# EAGLE design PiezoPreamp_V3 (EAGLE 7.5.0)
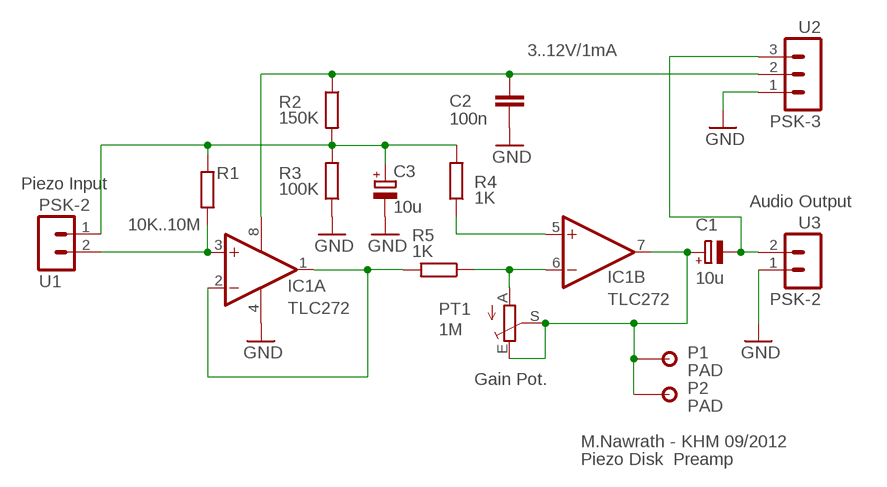
[diagram p0: schematic, sheet 1]

## Parts
C1  10u  CPOL-EUE2.5-5  [E2,5-5]
C2  100n  C-EU025-025X050  [C025-025X050]
C3  10u  CPOL-EUE2.5-5  [E2,5-5]
IC1  TLC272  TLC272P  [DIL08]
P1  PAD  PADL2  [PAD127L1]
P2  PAD  PADL2  [PAD127L1]
PT1  1M  TRIM_EU-CA6V  [CA6V]
R1  10K..10M  R-EU_0204/5  [0204/5]
R2  150K  R-EU_0204/5  [0204/5]
R3  100K  R-EU_0204/5  [0204/5]
R4  1K  R-EU_0204/5  [0204/5]
R5  1K  R-EU_0204/5  [0204/5]
U1  PSK-2  [PSK254/2]
U2  PSK-3  [PSK254/3]
U3  PSK-2  [PSK254/2]

## Nets
GND: C2.1 C3.- IC1.4(P:V-) R3.1 U2.1 U3.1
N$2: IC1.6(B:-IN) PT1.A R5.1
N$3: C1.- U2.3 U3.2
N$5: IC1.5(B:+IN) R4.1
N$6: C1.+ IC1.7(B:OUT) P1.P$2 P2.P$2 PT1.E PT1.S
N$14: IC1.1(A:OUT) IC1.2(A:-IN) R5.2
N$15: IC1.3(A:+IN) R1.1 U1.2
N$20: C3.+ R1.2 R2.2 R3.2 R4.2 U1.1
V9V: C2.2 IC1.8(P:V+) R2.1 U2.2

## Notes on the sheet
- 3..12V/1mA
- Piezo Input
- Audio Output
- Gain Pot.
- M.Nawrath - KHM 09/2012
- Piezo Disk  Preamp

## Library data of the parts
C1 C3 = rcl:CPOL-EU: POLARIZED CAPACITOR, European symbol
C2 = rcl:C-EU: CAPACITOR, European symbol
IC1 = linear:TLC272: OP AMP
P1 P2 = 2martin:PAD
PT1 = pot:TRIM_EU-: POTENTIOMETER
R1-R5 = rcl:R-EU_: RESISTOR, European symbol
U1 U3 = 2martin:PSK-2
U2 = 2martin:PSK-3

## Board
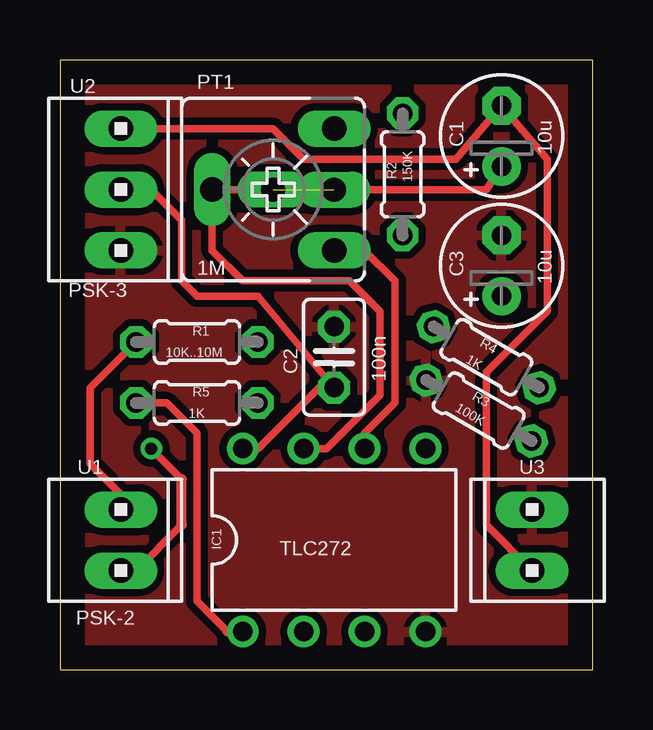
[diagram p1: board, top side]
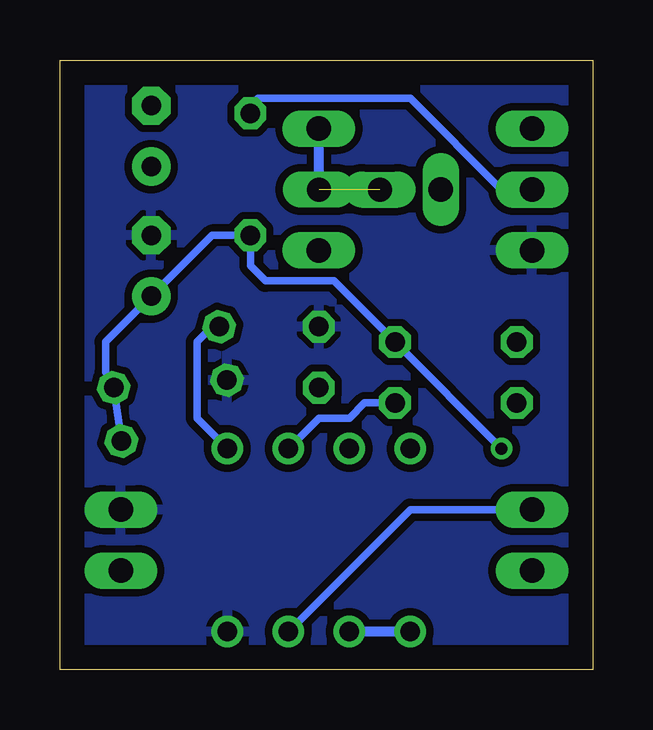
[diagram p2: board, bottom side, seen from below]

Size 22.23 x 25.4 mm. Coordinates in mm from the lower left corner, seen from the top.
Outline: 0,0 22.23,0 22.23,25.4 0,25.4 0,0
Copper layers (1*16): Top 0.035mm / dielectric 1.5mm / Bottom 0.035mm
Design rules "default": minimum track width 10mil, minimum drill 24mil, track to track 8mil, track to pad 8mil, pad to pad 8mil, via to via 8mil, smd to smd 8mil, copper to edge 40mil, drill to drill 8mil, minimum pad ring 10mil, minimum via ring 8mil, stop-mask expansion 4mil, vias tented up to drill 0mil, thermal gap 10mil

### Footprints (pad centres in the part's own frame; a part is rotated, then mirrored left to right if it is on the bottom)
E2,5-5 = drill 0.813 pad 1.6: + -1.27,0 | drill 0.813 pad 1.6 octagon: - 1.27,0
C025-025X050 = drill 0.813 octagon: 1 -1.27,0; 2 1.27,0
DIL08 = drill 0.813 pad 1.27: 1 -3.81,-3.81; 2 -1.27,-3.81; 3 1.27,-3.81; 4 3.81,-3.81; 5 3.81,3.81; 6 1.27,3.81; 7 -1.27,3.81; 8 -3.81,3.81
PAD127L1 = drill 1 long: P$2 0,0
CA6V = drill 1.016 long: A -2.54,-2.54; E 2.54,-2.54; S 0,2.54
0204/5 = drill 0.813 octagon: 1 -2.54,0; 2 2.54,0
PSK254/2 = drill 1.016 long: 1 0,0; 2 -2.54,0
PSK254/3 = drill 1.016 long: 1 2.54,0; 2 0,0; 3 -2.54,0

### Placement (x,y rotation side)
C1  18.41,22.23 90 top
C2  11.43,13.02 270 top
C3  18.41,16.83 90 top
IC1  11.43,5.4 0 top
P1  11.43,20 180 top
P2  8.89,20 0 top
PT1  8.89,20 90 top
R1  5.71,13.65 0 top
R2  14.29,20.64 270 top
R3  17.46,10.79 330 top
R4  17.78,13.02 330 top
R5  5.71,11.11 180 top
U1  2.54,4.13 270 top
U2  2.54,20 270 top
U3  19.68,6.67 90 top

### Tracks (layer width: path | path; a pad name or v marks a point on that pad's centre or on a via)
GND
  pour Bottom (isolate 0.305): 0,25.4 22.23,25.4 22.23,0 0,0
  pour Top (isolate 0.305): 0,25.4 22.23,25.4 22.23,0 0,0
N$2
  Top 0.305: PT1.A 12.7,17.46 13.97,16.19 13.97,11.11 12.7,9.84 IC1.6
  Bottom 0.305: IC1.6 11.43,10.48 10.16,10.48 9.53,11.11 R5.1
N$3
  Top 0.305: U2.3 8.89,22.54 10.16,21.27 16.51,21.27 C1.- 20.32,21.27 20.32,14.92 17.78,12.38 17.78,6.03 U3.2
N$5
  Bottom 0.305: IC1.5 16.51,10.48 16.51,13.65 15.88,14.29 R4.1
N$6  (1 unrouted)
  Top 0.305: P2.P$2 PT1.S 6.35,17.46 7.62,16.19 12.06,16.19 13.34,14.92 13.34,11.43 11.11,9.21 IC1.7 | P1.P$2 17.78,20 C1.+
  Bottom 0.406: P1.P$2 PT1.E
N$14
  Top 0.305: 6.99,1.59 5.71,2.86 5.71,9.84 4.45,11.11 R5.2
  Top 0.406: 6.99,1.59 IC1.1
  Bottom 0.406: IC1.1 IC1.2
N$15
  Top 0.305: R1.1 1.27,11.75 1.27,8.57 2.54,7.3 U1.2
  Bottom 0.305: IC1.3 7.62,6.67 U1.2
N$20  (via drill 0.5)
  Top 0.305: U1.1 3.17,4.13 5.08,6.03 | 5.08,7.94 v3.81,9.21
  Top 0.406: 5.08,6.03 5.08,7.94
  Bottom 0.305: v3.81,9.21 R1.2 10.79,16.19 13.65,16.19 14.29,16.83 R2.2 15.88,18.1 C3.+ 20.32,13.65 20.32,12.38 19.98,12.04 R4.2 R3.2
V9V
  Top 0.305: U2.2 3.81,20 5.08,18.73 5.08,16.19 5.71,15.56 8.26,15.56 C2.2 10.79,11.75 8.26,9.21 IC1.8
  Bottom 0.305: R2.1 14.29,23.5 13.97,23.81 7.62,23.81 3.81,20 U2.2